# EAGLE design miniboard (EAGLE 9.6.2)
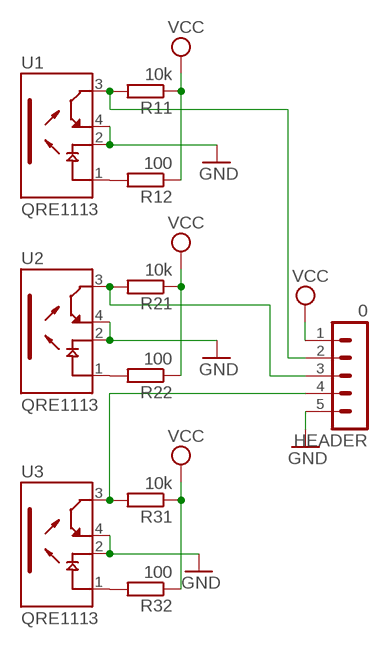
[diagram p0: schematic, sheet 1]

## Parts
HEADER  0  MA05-1  [MA05-1]
R11  10k  R-EU_0207/10  [0207/10]
R12  100  R-EU_0207/10  [0207/10]
R21  10k  R-EU_0207/10  [0207/10]
R22  100  R-EU_0207/10  [0207/10]
R31  10k  R-EU_0207/10  [0207/10]
R32  100  R-EU_0207/10  [0207/10]
U1  QRE1113  [DIP400W50P180L360H200Q4]
U2  QRE1113  [DIP400W50P180L360H200Q4]
U3  QRE1113  [DIP400W50P180L360H200Q4]

## Nets
GND: HEADER.5 U1.2(C) U1.4(ET) U2.2(C) U2.4(ET) U3.2(C) U3.4(ET)
N$1: HEADER.4 R31.2 U3.3(CT)
N$2: HEADER.2 R11.2 U1.3(CT)
N$3: R32.2 U3.1(A)
N$4: R22.2 U2.1(A)
N$5: HEADER.3 R21.2 U2.3(CT)
N$7: R12.2 U1.1(A)
VCC: HEADER.1 R11.1 R12.1 R21.1 R22.1 R31.1 R32.1

## Library data of the parts
HEADER = con-lstb:MA05-1: PIN HEADER; OC_FARNELL: unknown; OC_NEWARK: unknown
R11 R12 R21 R22 R31 R32 = rcl:R-EU_: RESISTOR, European symbol; SPICEPREFIX: R
U1-U3 = QRE1113-2:QRE1113: Reflective object sensor; AVAILABILITY: Unavailable; DESCRIPTION: OPTOCOUPLER, PHOTOTRANSISTOR; No. of Channels: 1; Optocoupler Output Type: Phototr; MANUFACTURER: On Semiconductor; MP: QRE1113; PACKAGE: DIP-4 ON Semiconductor; PARTREV: 5; PRICE: None; STANDARD: IPC-7251

## Board
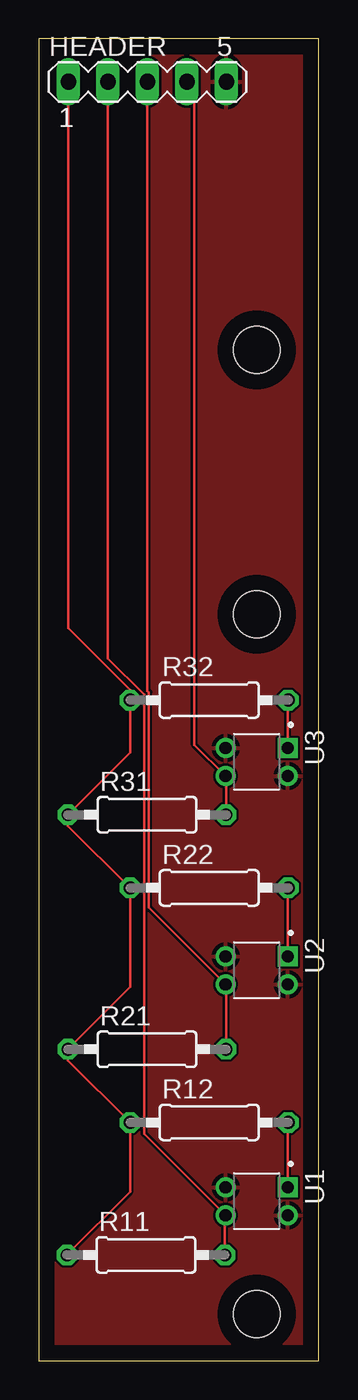
[diagram p1: board, top side]
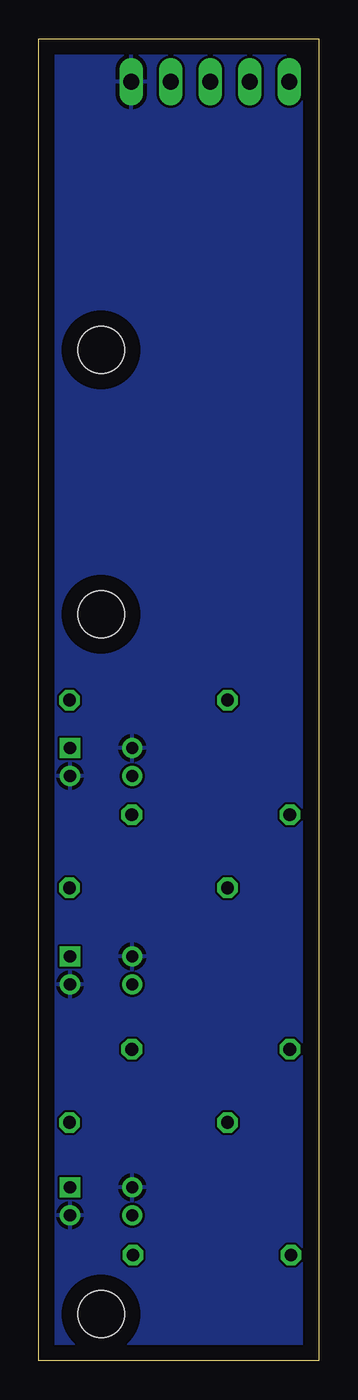
[diagram p2: board, bottom side, seen from below]

Size 18 x 85 mm. Coordinates in mm from the lower left corner, seen from the top.
Outline: 0,0 18,0 18,85 0,85 0,0
Copper layers (1*16): Top 0.035mm / dielectric 1.5mm / Bottom 0.035mm
Design rules "default": minimum track width 6mil, minimum drill 0.35mm, track to track 6mil, track to pad 6mil, pad to pad 6mil, via to via 6mil, smd to smd 6mil, copper to edge 40mil, drill to drill 6mil, minimum pad ring 10mil, minimum via ring 8mil, stop-mask expansion 4mil, vias tented up to drill 0mil, thermal gap 10mil
Holes 3 mm at 14,3 14,48 14,65

### Footprints (pad centres in the part's own frame; a part is rotated, then mirrored left to right if it is on the bottom)
MA05-1 = drill 1.016 long: 1 -5.08,0; 2 -2.54,0; 3 0,0; 4 2.54,0; 5 5.08,0
0207/10 = drill 0.813 octagon: 1 -5.08,0; 2 5.08,0
DIP400W50P180L360H200Q4 = drill 0.78 square: 1 -0.9,2 | drill 0.78: 2 -0.9,-2; 3 0.9,-2; 4 0.9,2

### Placement (x,y rotation side)
HEADER  6.98,82.24 0 top
R11  6.88,6.8 0 top
R12  10.95,15.32 0 top
R21  6.95,20.02 0 top
R22  10.95,30.4 0 top
R31  6.95,35.1 0 top
R32  10.95,42.48 0 top
U1  14,10.25 270 top
U2  14,25.1 270 top
U3  14,38.5 270 top

### Tracks (layer width: path | path; a pad name or v marks a point on that pad's centre or on a via)
GND
  pour Top: 0,85 18,85 18,0 0,0
  pour Bottom: 0,85 18,85 18,0 0,0
N$1
  Top 0.152: R31.2 12.03,37.57 U3.3 10,39.6 10,81.76 HEADER.4
N$2
  Top 0.152: R11.2 11.96,9.31 U1.3 6.76,14.59 6.76,42.85 4.44,45.17 HEADER.2
N$3
  Top 0.152: U3.1 16,42.45 R32.2
N$4
  Top 0.152: U2.1 16,30.37 R22.2
N$5
  Top 0.152: R21.2 12.03,24.17 U2.3 7.06,29.14 7.06,42.97 6.98,43.06 HEADER.3
N$7
  Top 0.152: U1.1 16,15.29 R12.2
VCC
  Top 0.152: R11.1 5.87,10.87 R12.1 1.87,19.32 R21.1 5.87,24.02 R22.1 1.87,34.4 R31.1 5.87,39.1 R32.1 5.87,43.13 1.9,47.1 HEADER.1